# EasyEDA schematic LcsNodes-Building-Block-RailCom-Detector-2.json
TITLE: Dual RailCom Detector; REV: A.01.00; Date: 2022-09-21; Sheet: 1/1; Drawn By: helmut-f; Company: Your Company
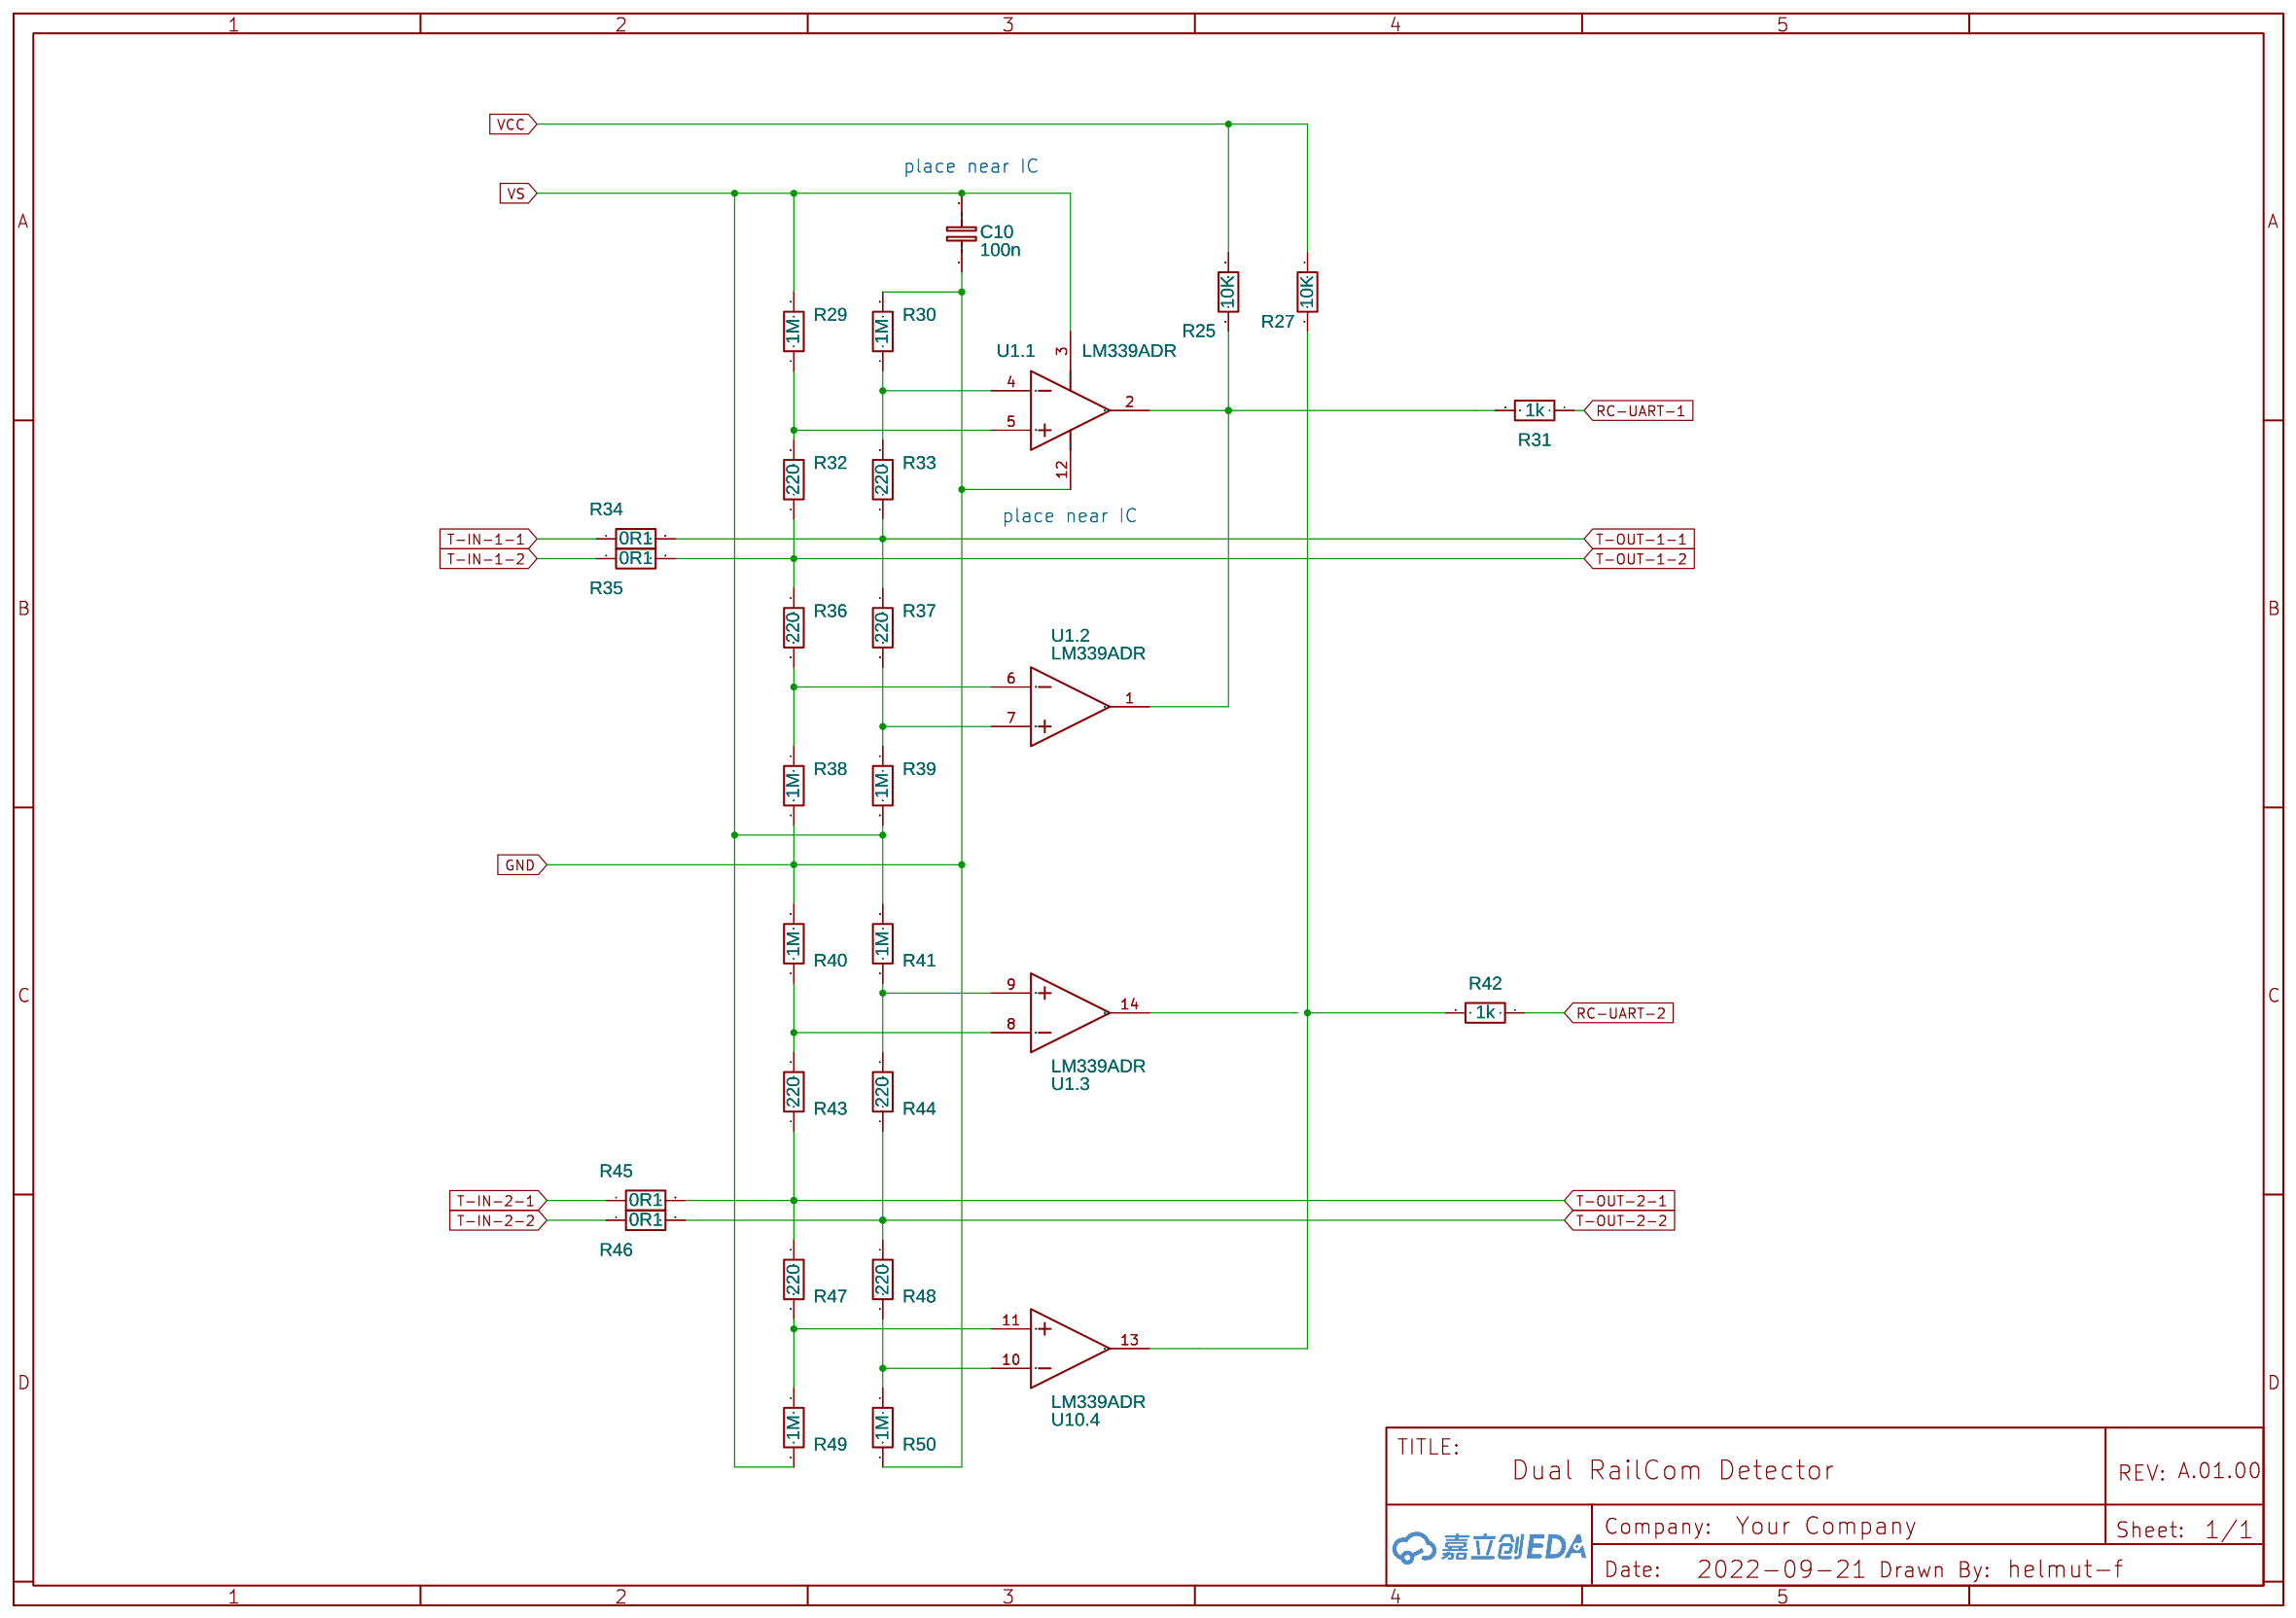
[diagram p0: schematic sheet]

## Parts
C10  100n  [C1206]
R25  10K  [R1206]
R27  10K  [R1206]
R29  1M  [R1206]
R30  1M  [R1206]
R31  1k  [R1206]
R32  220  [R1206]
R33  220  [R1206]
R34  0R1  [L_AXIAL-0.5]
R35  0R1  [L_AXIAL-0.5]
R36  220  [R1206]
R37  220  [R1206]
R38  1M  [R1206]
R39  1M  [R1206]
R40  1M  [R1206]
R41  1M  [R1206]
R42  1k  [R1206]
R43  220  [R1206]
R44  220  [R1206]
R45  0R1  [L_AXIAL-0.5]
R46  0R1  [L_AXIAL-0.5]
R47  220  [R1206]
R48  220  [R1206]
R49  1M  [R1206]
R50  1M  [R1206]
U1  LM339ADR  [SO-14_L8.6-W3.9-P1.27-LS6.0-BL]  (sections 1,2,3)
U10  LM339ADR  [SO-14_L8.6-W3.9-P1.27-LS6.0-BL]  (section 4)

## Library data of the parts
C10 = C_0603_EU: Contributor: LCEDA_Lib; Package Display: No
R25 R27 R29-R50 = R_AXIAL-0.3_EU: Contributor: LCEDA_Lib
U1 U10 = LM339ADR: Supplier Part: C74559; Supplier: LCSC; Manufacturer Part: TI; subpart_no: 1; JLCPCB Part Class: Extended Part

## Nets
GND: C10.1 R30.2 R38.2 R40.2 R50.2 U1.12(GND)
VCC: R25.2 R27.1
RC-UART-1: R31.1
RC-UART-2: R42.1
T-IN-1-1: R34.1
T-IN-1-2: R35.1
T-IN-2-1: R45.1
T-IN-2-2: R46.1
T-OUT-1-1: R33.1 R34.2 R37.1
T-OUT-1-2: R32.1 R35.2 R36.1
T-OUT-2-1: R43.1 R45.2 R47.1
T-OUT-2-2: R44.1 R46.2 R48.1
VS: C10.2 R29.2 R39.2 R41.2 R49.2 U1.3(VCC)
Net-(R25-1): R25.1 R31.2 U1.1(OUT1) U1.2(OUT2)
Net-(R27-2): R27.2 R42.2 U10.13(OUT4)
Net-(R29-1): R29.1 R32.2 U1.5(IN2+)
Net-(R30-1): R30.1 R33.2 U1.4(IN2-)
Net-(R36-2): R36.2 R38.1 U1.6(IN1-)
Net-(R37-2): R37.2 R39.1 U1.7(IN1+)
Net-(R40-1): R40.1 R43.2 U1.8(IN3-)
Net-(R41-1): R41.1 R44.2 U1.9(IN3+)
Net-(R47-2): R47.2 R49.1 U10.11(IN4+)
Net-(R48-2): R48.2 R50.1 U10.10(IN4-)

Not connected (* = marked no-connect by the designer): U1 14(OUT3)

## Notes on the sheet
- place near IC
- place near IC
